# Altium project main_adapter_board_2016.PrjPcb
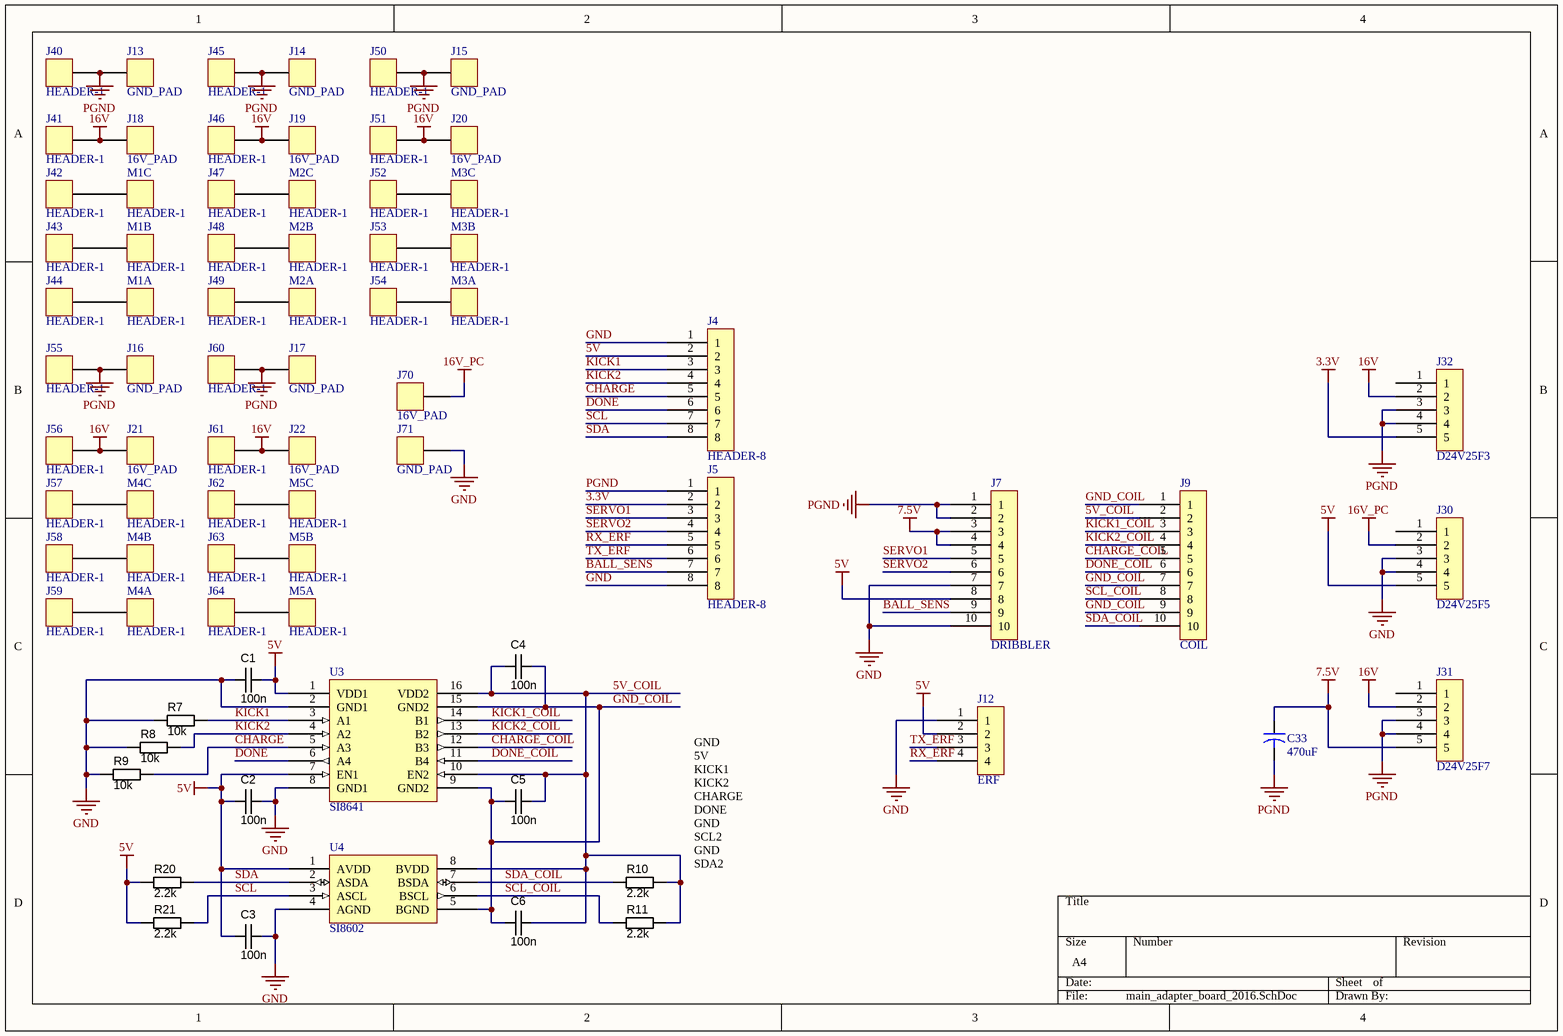
[diagram p0: main_adapter_board_2016.SchDoc]
1 sheet, 76 parts. Net scope: global (net labels, ports and power ports of the same name join across sheets).
Board file: main_adapter_board_2016.PcbDoc

## Sheet main_adapter_board_2016.SchDoc
size A4

### Parts
C1  100n  [CAPC1608X90N]
C2  100n  [CAPC1608X90N]
C3  100n  [CAPC1608X90N]
C4  100n  [CAPC1608X90N]
C5  100n  [CAPC1608X90N]
C6  100n  [CAPC1608X90N]
C33  470uF  [CAPR5-4X5]
J4  HEADER-8  [MICRO-MATCH-8]
J5  HEADER-8  [MICRO-MATCH-8]
J7  DRIBBLER  [MICRO-MATCH-10]
J9  COIL  [MICRO-MATCH-10]
J12  ERF  [MICRO-MATCH-4]
J13  GND_PAD  [POWER-PAD]
J14  GND_PAD  [POWER-PAD]
J15  GND_PAD  [POWER-PAD]
J16  GND_PAD  [POWER-PAD]
J17  GND_PAD  [POWER-PAD]
J18  16V_PAD  [POWER-PAD]
J19  16V_PAD  [POWER-PAD]
J20  16V_PAD  [POWER-PAD]
J21  16V_PAD  [POWER-PAD]
J22  16V_PAD  [POWER-PAD]
J30  D24V25F5  [PIN-HEADER-5]
J31  D24V25F7  [PIN-HEADER-5]
J32  D24V25F3  [PIN-HEADER-5]
J40  HEADER-1  [2MM-BULLET-PLUG-VIA]
J41  HEADER-1  [2MM-BULLET-PLUG-VIA]
J42  HEADER-1  [2MM-BULLET-PLUG-VIA]
J43  HEADER-1  [2MM-BULLET-PLUG-VIA]
J44  HEADER-1  [2MM-BULLET-PLUG-VIA]
J45  HEADER-1  [2MM-BULLET-PLUG-VIA]
J46  HEADER-1  [2MM-BULLET-PLUG-VIA]
J47  HEADER-1  [2MM-BULLET-PLUG-VIA]
J48  HEADER-1  [2MM-BULLET-PLUG-VIA]
J49  HEADER-1  [2MM-BULLET-PLUG-VIA]
J50  HEADER-1  [2MM-BULLET-PLUG-VIA]
J51  HEADER-1  [2MM-BULLET-PLUG-VIA]
J52  HEADER-1  [2MM-BULLET-PLUG-VIA]
J53  HEADER-1  [2MM-BULLET-PLUG-VIA]
J54  HEADER-1  [2MM-BULLET-PLUG-VIA]
J55  HEADER-1  [2MM-BULLET-PLUG-VIA]
J56  HEADER-1  [2MM-BULLET-PLUG-VIA]
J57  HEADER-1  [2MM-BULLET-PLUG-VIA]
J58  HEADER-1  [2MM-BULLET-PLUG-VIA]
J59  HEADER-1  [2MM-BULLET-PLUG-VIA]
J60  HEADER-1  [2MM-BULLET-PLUG-VIA]
J61  HEADER-1  [2MM-BULLET-PLUG-VIA]
J62  HEADER-1  [2MM-BULLET-PLUG-VIA]
J63  HEADER-1  [2MM-BULLET-PLUG-VIA]
J64  HEADER-1  [2MM-BULLET-PLUG-VIA]
J70  16V_PAD  [POWER-PAD-4x3]
J71  GND_PAD  [POWER-PAD-4x3]
M1A  HEADER-1  [2MM-BULLET-VIA]
M1B  HEADER-1  [2MM-BULLET-VIA]
M1C  HEADER-1  [2MM-BULLET-VIA]
M2A  HEADER-1  [2MM-BULLET-VIA]
M2B  HEADER-1  [2MM-BULLET-VIA]
M2C  HEADER-1  [2MM-BULLET-VIA]
M3A  HEADER-1  [2MM-BULLET-VIA]
M3B  HEADER-1  [2MM-BULLET-VIA]
M3C  HEADER-1  [2MM-BULLET-VIA]
M4A  HEADER-1  [2MM-BULLET-VIA]
M4B  HEADER-1  [2MM-BULLET-VIA]
M4C  HEADER-1  [2MM-BULLET-VIA]
M5A  HEADER-1  [2MM-BULLET-VIA]
M5B  HEADER-1  [2MM-BULLET-VIA]
M5C  HEADER-1  [2MM-BULLET-VIA]
R7  10k  [RESC1608X55N]
R8  10k  [RESC1608X55N]
R9  10k  [RESC1608X55N]
R10  2.2k  [RESC1608X55N]
R11  2.2k  [RESC1608X55N]
R20  2.2k  [RESC1608X55N]
R21  2.2k  [RESC1608X55N]
U3  SI8641  [SOIC16]
U4  SI8602  [SOIC8]

### Nets
3.3V: J5.2 J32.5
5V: C1.1 C2.2 C3.2 J4.2 J7.8 J12.2 J30.5 R20.1 R21.1 U3.1(VDD1) U3.7(EN1) U4.1(AVDD)
7.5V: C33.1 J7.3 J7.4 J31.5
16V: J18.1 J19.1 J20.1 J21.1 J22.1 J31.2 J32.2 J41.1 J46.1 J51.1 J56.1 J61.1
16V_PC: J30.2 J70.1
GND: C1.2 C2.1 C3.1 J4.1 J5.8 J7.7 J7.10 J12.1 J30.3 J30.4 J71.1 R7.1 R8.1 R9.1 U3.2(GND1) U3.8(GND1) U4.4(AGND)
PGND: C33.2 J5.1 J7.1 J7.2 J13.1 J14.1 J15.1 J16.1 J17.1 J31.3 J31.4 J32.3 J32.4 J40.1 J45.1 J50.1 J55.1 J60.1
5V_COIL: C4.2 C5.1 C6.1 J9.2 R10.2 R11.2 U3.10(EN2) U3.16(VDD2) U4.8(BVDD)
BALL_SENS: J5.7 J7.9
CHARGE: J4.5 R9.2 U3.5(A3)
CHARGE_COIL: J9.5 U3.12(B3)
DONE: J4.6 U3.6(A4)
DONE_COIL: J9.6 U3.11(B4)
GND_COIL: C4.1 C5.2 C6.2 J9.1 J9.7 J9.9 U3.9(GND2) U3.15(GND2) U4.5(BGND)
KICK1: J4.3 R7.2 U3.3(A1)
KICK1_COIL: J9.3 U3.14(B1)
KICK2: J4.4 R8.2 U3.4(A2)
KICK2_COIL: J9.4 U3.13(B2)
RX_ERF: J5.5 J12.4
SCL: J4.7 R21.2 U4.3(ASCL)
SCL_COIL: J9.8 R11.1 U4.6(BSCL)
SDA: J4.8 R20.2 U4.2(ASDA)
SDA_COIL: J9.10 R10.1 U4.7(BSDA)
SERVO1: J5.3 J7.5
SERVO2: J5.4 J7.6
TX_ERF: J5.6 J12.3
NetJ42_1: J42.1 M1C.1
NetJ43_1: J43.1 M1B.1
NetJ44_1: J44.1 M1A.1
NetJ47_1: J47.1 M2C.1
NetJ48_1: J48.1 M2B.1
NetJ49_1: J49.1 M2A.1
NetJ52_1: J52.1 M3C.1
NetJ53_1: J53.1 M3B.1
NetJ54_1: J54.1 M3A.1
NetJ57_1: J57.1 M4C.1
NetJ58_1: J58.1 M4B.1
NetJ59_1: J59.1 M4A.1
NetJ62_1: J62.1 M5C.1
NetJ63_1: J63.1 M5B.1
NetJ64_1: J64.1 M5A.1

Not connected (* = marked no-connect by the designer): J30 1; J31 1; J32 1

### Notes on the sheet
- GND
  5V
  KICK1
  KICK2
  CHARGE
  DONE
  GND
  SCL2
  GND
  SDA2

### Library data of the parts
C1-C6 = CAPC_100n_0603_X7R_50V_10%: Capacitor SMD Cer 100nF 10% 50V X7R 0603; Manufacturer 1: AVX Corporation; Manufacturer Part Number 1: 06035C104KAT2A; Ratings: 50V; X7R; Material: ceramic; SCDType: spec; Manufacturer 2: TDK Corporation; Manufacturer Part Number 2: C1608X7R1H104K; Package / Case: 0603 (1608 Metric); Tolerance: ±10%; Supplier 1: Digi-Key; Supplier Part Number 1: 478-5052-1-ND; ComponentLink1URL: http://www.avx.com/docs/Catalogs/cx7r.pdf; ComponentLink1Description: http://www.avx.com/docs/Catalogs/cx7r.pdf; Supplier 2: Digi-Key; Supplier Part Number 2: 445-1314-1-ND; ComponentLink2URL: http://product.tdk.com/capacitor/mlcc/en/documents/mlcc_commercial_general_en.pdf; ComponentLink2Description: http://product.tdk.com/capacitor/mlcc/en/documents/mlcc_commercial_general_en.pdf; Value: 100n
C33 = Cap2: Capacitor; Value: 100pF; Published: 23-Sep-2002; PackageReference: CAPR5-4X5; Publisher: Altium Limited; PackageDescription: Capacitor; 2 Leads
J7 J9 = HEADER-10
J12 = HEADER-4
J13-J22 J70 J71 = HEADER-1
J30-J32 = HEADER-5
R7-R11 R20 R21 = RES_120R_0603_5%: Resistor SMD chip 120 Ohm 0.1W 5% 0603; Manufacturer 1: Vishay Dale; Manufacturer Part Number 1: CRCW0603120RJNEA; Ratings: 1/10 W; SCDType: spec; Value: 120R; Package / Case: 0603 (1608 metric); Tolerance: ±5%; Material: Thick Film; Supplier 1: Digi-Key; Supplier Part Number 1: 541-120GCT-ND; ComponentLink1URL: http://www.vishay.com/doc?20035; ComponentLink1Description: http://www.vishay.com/doc?20035; Supplier 2: Digi-Key; Supplier Part Number 2: 311-120GRCT-ND; Manufacturer 2: Yageo; Manufacturer Part Number 2: RC0603JR-07120RL; ComponentLink2URL: http://www.yageo.com/documents/recent/PYu-RC0603_51_RoHS_L_4.pdf; ComponentLink2Description: http://www.yageo.com/documents/recent/PYu-RC0603_51_RoHS_L_4.pdf